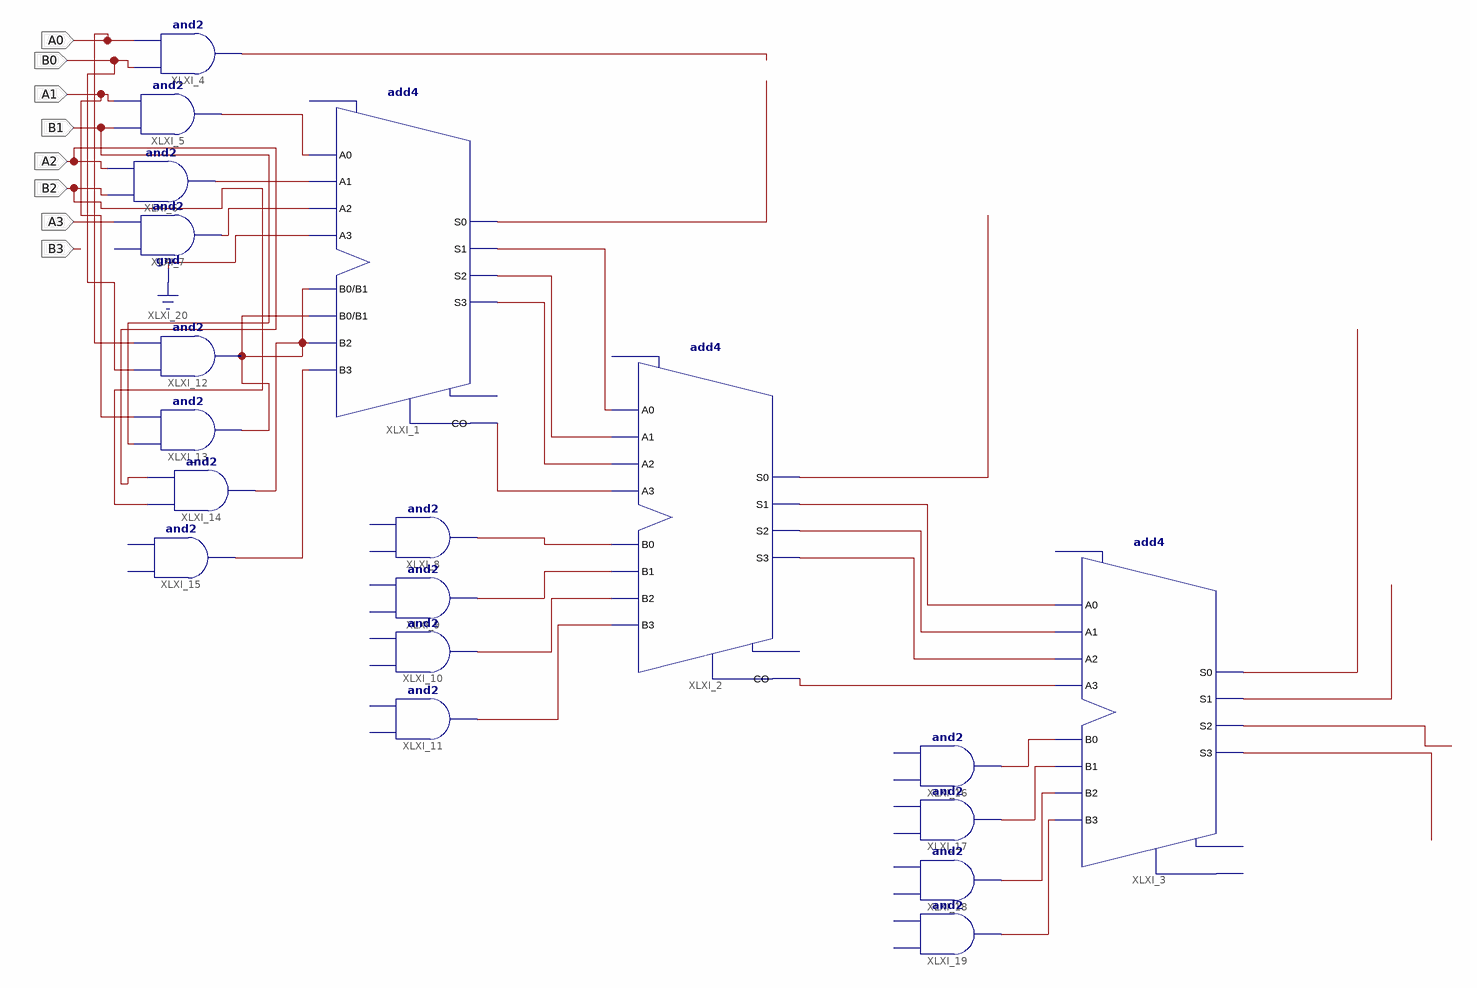
[diagram p0: schematic sheet 1]
// Xilinx ISE schematic main.sch (spartan6) as structural Verilog: 19 symbols, 8 ports
module main (
  input  A0,
  input  B0,
  input  A1,
  input  B1,
  input  A2,
  input  B2,
  input  A3,
  input  B3
);

  wire XLXN_1, XLXN_2, XLXN_3, XLXN_4, XLXN_8, XLXN_9, XLXN_11, XLXN_12, XLXN_13, XLXN_14, XLXN_15, XLXN_16,
       XLXN_17, XLXN_18, XLXN_19, XLXN_20, XLXN_21, XLXN_22, XLXN_23, XLXN_24, XLXN_25, XLXN_26, XLXN_28,
       XLXN_29, XLXN_30, XLXN_31, XLXN_32, XLXN_33, XLXN_52;

  add4 XLXI_1 (
    .A0(XLXN_2), .A1(XLXN_3), .A2(XLXN_4), .A3(1'b0), .B0(XLXN_52), .B1(XLXN_52), .B2(XLXN_8), .B3(XLXN_9),
    .CO(XLXN_15), .S0(XLXN_11), .S1(XLXN_12), .S2(XLXN_13), .S3(XLXN_14));  // open: CI, OFL
  add4 XLXI_2 (
    .A0(XLXN_12), .A1(XLXN_13), .A2(XLXN_14), .A3(XLXN_15), .B0(XLXN_16), .B1(XLXN_17), .B2(XLXN_18),
    .B3(XLXN_19), .CO(XLXN_24), .S0(XLXN_20), .S1(XLXN_21), .S2(XLXN_22), .S3(XLXN_23));  // open: CI, OFL
  add4 XLXI_3 (
    .A0(XLXN_21), .A1(XLXN_22), .A2(XLXN_23), .A3(XLXN_24), .B0(XLXN_25), .B1(XLXN_26), .B2(XLXN_28),
    .B3(XLXN_29), .S0(XLXN_30), .S1(XLXN_31), .S2(XLXN_32), .S3(XLXN_33));  // open: CI, CO, OFL
  and XLXI_4 (XLXN_1, B0, A0);
  and XLXI_5 (XLXN_2, B1, A1);
  and XLXI_6 (XLXN_3, B2, A2);
  and XLXI_7 (XLXN_4, A3, A3);
  // and2 XLXI_8 has open pins: I0=open, I1=open, O=XLXN_16
  // and2 XLXI_9 has open pins: I0=open, I1=open, O=XLXN_17
  // and2 XLXI_10 has open pins: I0=open, I1=open, O=XLXN_18
  // and2 XLXI_11 has open pins: I0=open, I1=open, O=XLXN_19
  and XLXI_12 (XLXN_52, B0, A0);
  and XLXI_13 (XLXN_52, B1, A1);
  and XLXI_14 (XLXN_52, B2, A2);
  // and2 XLXI_15 has open pins: I0=open, I1=open, O=XLXN_9
  // and2 XLXI_16 has open pins: I0=open, I1=open, O=XLXN_25
  // and2 XLXI_17 has open pins: I0=open, I1=open, O=XLXN_26
  // and2 XLXI_18 has open pins: I0=open, I1=open, O=XLXN_28
  // and2 XLXI_19 has open pins: I0=open, I1=open, O=XLXN_29
endmodule
